# Altium schematic sheet KeepTalkingV2_SevenSeg.SchDoc
size A; SheetNumber: 2; SheetTotal: 2
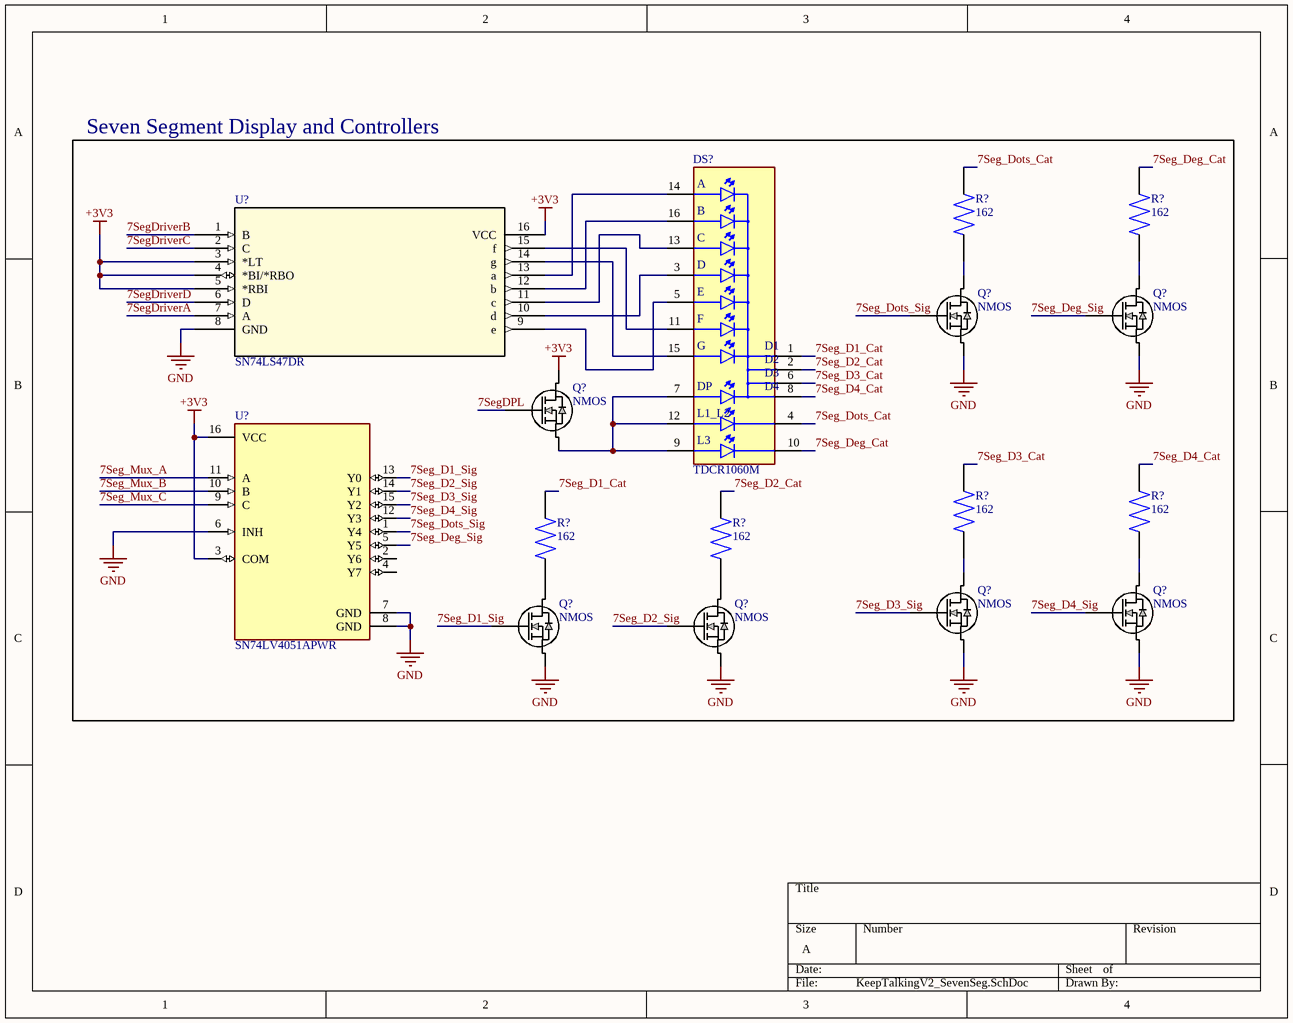
[diagram p0: KeepTalkingV2_SevenSeg.SchDoc]

## Parts
(Parts that share a designator on the sheet are numbered #1, #2 ... from top to bottom, then left to right.)
DS?  TDCR1060M  [16-DIP 4Char-7Seg]
Q?#1  NMOS  [SOT-323 MOS]
Q?#2  NMOS  [SOT-323 MOS]
Q?#3  NMOS  [SOT-323 MOS]
Q?#4  NMOS  [SOT-323 MOS]
Q?#5  NMOS  [SOT-323 MOS]
Q?#6  NMOS  [SOT-323 MOS]
Q?#7  NMOS  [SOT-323 MOS]
R?#1  162  [0805]
R?#2  162  [0805]
R?#3  162  [0805]
R?#4  162  [0805]
R?#5  162  [0805]
R?#6  162  [0805]
U?#1  SN74LS47DR  [16-SOIC 7-seg Driver]
U?#2  SN74LV4051APWR  [16-TSSOP MUX 8to1]

## Blocks framed on the sheet
Seven Segment Display and Controllers: DS? Q?#1-Q?#7 R?#1-R?#6 U?#1 U?#2

## Nets
+3V3: Q?#3.2(D) U?#1.3(*LT) U?#1.4(*BI/*RBO) U?#1.5(*RBI) U?#1.16(VCC) U?#2.3(COM) U?#2.16(VCC)
GND: Q?#1.3(S) Q?#2.3(S) Q?#4.3(S) Q?#5.3(S) Q?#6.3(S) Q?#7.3(S) U?#1.8(GND) U?#2.6(INH) U?#2.7(GND) U?#2.8(GND)
7Seg_D1_Cat: DS?.1(D1) R?#5.2
7Seg_D1_Sig: Q?#6.1(G) U?#2.13(Y0)
7Seg_D2_Cat: DS?.2(D2) R?#6.2
7Seg_D2_Sig: Q?#7.1(G) U?#2.14(Y1)
7Seg_D3_Cat: DS?.6(D3) R?#3.2
7Seg_D3_Sig: Q?#4.1(G) U?#2.15(Y2)
7Seg_D4_Cat: DS?.8(D4) R?#4.2
7Seg_D4_Sig: Q?#5.1(G) U?#2.12(Y3)
7Seg_Deg_Cat: DS?.10 R?#2.2
7Seg_Deg_Sig: Q?#2.1(G) U?#2.5(Y5)
7Seg_Dots_Cat: DS?.4 R?#1.2
7Seg_Dots_Sig: Q?#1.1(G) U?#2.1(Y4)
7Seg_Mux_A: U?#2.11(A)
7Seg_Mux_B: U?#2.10(B)
7Seg_Mux_C: U?#2.9(C)
7SegDPL: Q?#3.1(G)
7SegDriverA: U?#1.7(A)
7SegDriverB: U?#1.1(B)
7SegDriverC: U?#1.2(C)
7SegDriverD: U?#1.6(D)
NetDS?_3: DS?.3(D) U?#1.10(d)
NetDS?_5: DS?.5(E) U?#1.9(e)
NetDS?_7: DS?.7(DP) DS?.9(L3) DS?.12(L1_L2) Q?#3.3(S)
NetDS?_11: DS?.11(F) U?#1.15(f)
NetDS?_13: DS?.13(C) U?#1.11(c)
NetDS?_14: DS?.14(A) U?#1.13(a)
NetDS?_15: DS?.15(G) U?#1.14(g)
NetDS?_16: DS?.16(B) U?#1.12(b)
NetQ?#1_2: Q?#1.2(D) R?#1.1
NetQ?#2_2: Q?#2.2(D) R?#2.1
NetQ?#4_2: Q?#4.2(D) R?#3.1
NetQ?#5_2: Q?#5.2(D) R?#4.1
NetQ?#6_2: Q?#6.2(D) R?#5.1
NetQ?#7_2: Q?#7.2(D) R?#6.1

Not connected (* = marked no-connect by the designer): U?#2 2(Y6) 4(Y7)

## Library data of the parts
DS? = DISP 7-seg 4Char Clock: Clock LED Display, 4-Character, Red, 10mm; Manufacturer: Vishay; Forward Current: 25mA; Forward Voltage: 2.4V; Number of Characters: 4; Supplier: Digikey; Supplier Part Number: TDCR1060M-ND; Manufacturer Part Number: TDCR1060M; RoHS: Yes; Category: Optoelectronics; Stock: 3748; Pricing: 1=3.34, 12=2.39083, 108=1.8975, 504=1.67593, 1008=1.59991, 2004=1.53608, 5004=1.46597 (USD); Color: Red; Color@wavelength: Red; Min Operating Temperature: -40°C; Max Operating Temperature: 85°C; Display Height: 10mm; Channels: 4; Optoelectronic Device Type: CLOCK LED DISPLAY; RoHS Compliant: Yes; ComponentLink1URL: https://datasheet.ciiva.com:443/pdfs/VipMasterIC/IC/VISH/VISH-S-A0003301798/VISH-S-A0004391181-1.pdf?src-supplier=IHS+Markit; ComponentLink1Description: https://datasheet.ciiva.com:443/pdfs/VipMasterIC/IC/VISH/VISH-S-A0003301798/VISH-S-A0004391181-1.pdf?src-supplier=IHS+Markit; ComponentLink2URL: https://datasheet.ciiva.com/18549/tdc10m-18549753.pdf?src-supplier=Digikey; ComponentLink2Description: https://datasheet.ciiva.com/18549/tdc10m-18549753.pdf?src-supplier=Digikey
Q?#1-Q?#7 = MOS NMOS 20V 1A SOT323: Small Signal Field-Effect Transistor, 1A I(D), 20V, 1-Element, N-Channel, Silicon, Metal-oxide Semiconductor FET; Manufacturer: Diodes Zetex; Manufacturer Part Number: DMG1012UW-7; Package Body Material: Plastic; Time @ Peak Reflow Temperature-Max (s): 40s; Additional Feature: HIGH RELIABILITY; Drain-source On Resistance-Max: 450mR; Number of Elements: 1; Operating Mode: ENHANCEMENT MODE; Power Dissipation-Max (Abs): 290mW; Transistor Application: SWITCHING; Reference Standard: AEC-Q101; Qualification Status: Not Qualified; Supplier: Digikey; Supplier Part Number: DMG1012UW-7DICT-ND; RoHS: Yes; Category: MOSFETs; Stock: 318650; Pricing: 1=0.28, 10=0.143, 100=0.0714, 500=0.06828 (USD); Pins: 3; Package Shape: Rectangular; Terminal Finish: Tin; Transistor Element Material: SILICON; Max Operating Temperature: 150°C; JESD-609 Code: e3; JESD-30 Code: R-PDSO-G3; Moisture Sensitivity Level: 1; Package Style: SMALL OUTLINEMeter; Peak Reflow Temperature (Cel): 260°C; Surface Mount: Yes; Terminal Form: Gull Wing; Terminal Position: DUAL; Polarity/Channel Type: N-CHANNEL; Drain Current-Max (Abs) (ID): 1A; Drain Current-Max (ID): 1A; DS Breakdown Voltage-Min: 20V; FET Technology: METAL-OXIDE SEMICONDUCTOR; Reach SVHC Compliant: Yes; RoHS Compliant: Yes; ComponentLink1URL: https://datasheet.ciiva.com:443/pdfs/VipMasterIC/IC/DIOD/DIOD-S-A0009689761/DIOD-S-A0009691185-1.pdf?src-supplier=IHS+Markit; ComponentLink1Description: https://datasheet.ciiva.com:443/pdfs/VipMasterIC/IC/DIOD/DIOD-S-A0009689761/DIOD-S-A0009691185-1.pdf?src-supplier=IHS+Markit; ComponentLink2URL: https://datasheet.ciiva.com/11174/ds31859-11174966.pdf?src-supplier=Avnet; ComponentLink2Description: https://datasheet.ciiva.com/11174/ds31859-11174966.pdf?src-supplier=Avnet; ComponentLink3URL: https://datasheet.ciiva.com/4443/ds31859-90313-4443117.pdf?src-supplier=Mouser; ComponentLink3Description: https://datasheet.ciiva.com/4443/ds31859-90313-4443117.pdf?src-supplier=Mouser; ComponentLink4URL: https://datasheet.ciiva.com/6383/ds31859-6383798.pdf?src-supplier=Digikey; ComponentLink4Description: https://datasheet.ciiva.com/6383/ds31859-6383798.pdf?src-supplier=Digikey; ComponentLink5URL: https://datasheet.ciiva.com/6383/ds31859-6383800.pdf?src-supplier=Digikey; ComponentLink5Description: https://datasheet.ciiva.com/6383/ds31859-6383800.pdf?src-supplier=Digikey
R?#1-R?#6 = RES 162 1% 0.125W 0805: Fixed Resistor, Metal Glaze/thick Film, 0.125W, 162ohm, 150V, 1% +/-Tol, 100ppm/Cel, Surface Mount, 0805; Manufacturer: Yageo; Manufacturer Part Number: RC0805FR-07162RL; Additional Feature: LASER TRIMMABLE; Power: 125mW; Rated Temperature: 70°C; Value: 162R; Temperature Coefficient (ppm/Cel): 100; Package Height: 0.5mm; Package Length: 2mm; Package Width: 1.25mm; Supplier: Digikey; Supplier Part Number: 311-162CRCT-ND; RoHS: Yes; Category: Chip SMD Resistors; Stock: 65718; Pricing: 1=0.1, 10=0.013, 100=0.0112, 1000=0.00816, 2500=0.00735 (USD); Mounting Technology: Surface Mount; Pins: 2; Package Shape: Rectangular; Case/Package: 0805; Terminal Finish: Nickel; Min Operating Temperature: -55°C; Max Operating Temperature: 155°C; Tolerance: 1%; JESD-609 Code: e3; Resistor Type: FIXED RESISTOR; Construction: Chip; Packaging: Tape and Reel; Technology: METAL GLAZE/THICK FILM; Termination: Wraparound; Working Voltage: 150V; Reach SVHC Compliant: Yes; RoHS Compliant: Yes; ComponentLink1URL: https://datasheet.ciiva.com:443/pdfs/VipMasterIC/IC/YAGO/YAGO-S-A0008145938/YAGO-S-A0008145938-1.pdf?src-supplier=IHS+Markit; ComponentLink1Description: https://datasheet.ciiva.com:443/pdfs/VipMasterIC/IC/YAGO/YAGO-S-A0008145938/YAGO-S-A0008145938-1.pdf?src-supplier=IHS+Markit; ComponentLink2URL: https://datasheet.ciiva.com/2457/pyu-r-int-thick-7-2457830.pdf?src-supplier=Digikey; ComponentLink2Description: https://datasheet.ciiva.com/2457/pyu-r-int-thick-7-2457830.pdf?src-supplier=Digikey; ComponentLink3URL: https://datasheet.ciiva.com/2457/pyu-r-int-thick-7-2457831.pdf?src-supplier=Digikey; ComponentLink3Description: https://datasheet.ciiva.com/2457/pyu-r-int-thick-7-2457831.pdf?src-supplier=Digikey; ComponentLink4URL: https://datasheet.ciiva.com/2457/pyu-r-int-thick-7-2457832.pdf?src-supplier=Digikey; ComponentLink4Description: https://datasheet.ciiva.com/2457/pyu-r-int-thick-7-2457832.pdf?src-supplier=Digikey
U?#1 = IC DRVR 7 SEG SN74LS47DR: Seven Segment Decoder/Driver, LS Series, Inverted Output, TTL, PDSO16; Manufacturer: Texas Instruments; Package Body Material: Plastic; Input Conditioning: STANDARD; Load Capacitance (CL): 15pF; Channels: 1; Output Characteristics: OPEN-COLLECTOR; Power Supply Current-Max (ICC): 13mA; Propagation Delay (tpd): 100ns; Max Supply Voltage: 5.5V; Min Supply Voltage: 4.75V; Nominal Supply Voltage: 5V; Qualification Status: Not Qualified; Supplier: Digikey; Supplier Part Number: 296-46894-1-ND; Manufacturer Part Number: SN74LS47DR; RoHS: Yes; Category: Integrated Circuits (ICs); Stock: 3469; Pricing: 1=1.33, 10=0.967, 25=0.876, 100=0.7762, 250=0.72848, 500=0.70992 (USD); Case/Package: SOP; Pins: 16; Package Shape: Rectangular; Terminal Finish: Nickel; Min Operating Temperature: 0°C; Max Operating Temperature: 70°C; JESD-609 Code: e4; Output Polarity: INVERTED; JESD-30 Code: R-PDSO-G16; Logic Type: SEVEN SEGMENT DECODER/DRIVER; Moisture Sensitivity Level: 1; Package Style: SMALL OUTLINEMeter; Peak Reflow Temperature (Cel): 260°C; Surface Mount: Yes; Technology: TTL; Terminal Form: Gull Wing; Terminal Position: DUAL; Length: 9.9mm; Width: 3.9mm; Height - Seated (Max): 1.75mm; Terminal Pitch: 1.27mm; Temperature Grade: COMMERCIAL; Reach SVHC Compliant: Yes; RoHS Compliant: Yes; ComponentLink1URL: https://www.ti.com:443/lit/ds/symlink/sn5447a.pdf?src-supplier=IHS+Markit; ComponentLink1Description: https://www.ti.com:443/lit/ds/symlink/sn5447a.pdf?src-supplier=IHS+Markit; ComponentLink2URL: https://datasheet.ciiva.com/14293/sn74ls47-14293676.pdf?src-supplier=Avnet; ComponentLink2Description: https://datasheet.ciiva.com/14293/sn74ls47-14293676.pdf?src-supplier=Avnet
U?#2 = IC MUX 8:1 SN74LV4051APWR: Single-Ended Multiplexer, 1 Func, 8 Channel, CMOS, PDSO16; Manufacturer: Texas Instruments; Package Body Material: Plastic; Number of Channels: 8; Channels: 1; Off-state Isolation-Nom: 45dB; On-state Resistance Match-Nom: 2.1R; On-state Resistance-Max (Ron): 180R; Package Equivalence Code: TSSOP16,.25; Power Supplies: 3.3V; Signal Current-Max: 50mA; Supply Current-Max (Isup): 20uA; Max Supply Voltage: 5.5V; Min Supply Voltage: 2V; Nominal Supply Voltage: 2.3V; Switch-off Time-Max: 28ns; Qualification Status: Not Qualified; Supplier: Digikey; Supplier Part Number: 296-3829-1-ND; Manufacturer Part Number: SN74LV4051APWR; RoHS: Yes; Category: Decoders and Multiplexers; Stock: 20567; Pricing: 1=0.27, 10=0.189, 25=0.1672, 100=0.1435, 250=0.13224, 500=0.12538, 1000=0.11977 (USD); Case/Package: TSSOP; Pins: 16; Package Shape: Rectangular; Terminal Finish: Tin; Min Operating Temperature: -40°C; Max Operating Temperature: 85°C; JESD-609 Code: e3; Throw Configuration: SINGLE-ENDED MULTIPLEXER; JESD-30 Code: R-PDSO-G16; Moisture Sensitivity Level: 1; Package Style: SMALL OUTLINE, THIN PROFILE, SHRINK PITCHMeter; Peak Reflow Temperature (Cel): 260°C; Surface Mount: Yes; Switch-on Time-Max: 28ns; Technology: CMOS; Terminal Form: Gull Wing; Terminal Position: DUAL; Length: 5mm; Width: 4.4mm; Height - Seated (Max): 1.2mm; Terminal Pitch: 0.65mm; Temperature Grade: INDUSTRIAL; Reach SVHC Compliant: Yes; RoHS Compliant: Yes; ComponentLink1URL: https://www.ti.com:443/lit/ds/symlink/sn74lv4051a.pdf?src-supplier=IHS+Markit; ComponentLink1Description: https://www.ti.com:443/lit/ds/symlink/sn74lv4051a.pdf?src-supplier=IHS+Markit; ComponentLink2URL: https://datasheet.ciiva.com/27051/1026350-27051257.pdf?src-supplier=Jameco; ComponentLink2Description: https://datasheet.ciiva.com/27051/1026350-27051257.pdf?src-supplier=Jameco; ComponentLink3URL: https://datasheet.ciiva.com/15127/getdatasheetpartid-300450-15127659.pdf?src-supplier=Verical; ComponentLink3Description: https://datasheet.ciiva.com/15127/getdatasheetpartid-300450-15127659.pdf?src-supplier=Verical; ComponentLink4URL: https://datasheet.ciiva.com/1669/sn74lv4051a-1669786.pdf?src-supplier=Digikey; ComponentLink4Description: https://datasheet.ciiva.com/1669/sn74lv4051a-1669786.pdf?src-supplier=Digikey; ComponentLink5URL: https://datasheet.ciiva.com/1669/sn74lv4051a-1669787.pdf?src-supplier=Digikey; ComponentLink5Description: https://datasheet.ciiva.com/1669/sn74lv4051a-1669787.pdf?src-supplier=Digikey; ComponentLink6URL: https://datasheet.ciiva.com/1669/sn74lv4051a-1669788.pdf?src-supplier=Digikey; ComponentLink6Description: https://datasheet.ciiva.com/1669/sn74lv4051a-1669788.pdf?src-supplier=Digikey; ComponentLink7URL: https://datasheet.ciiva.com/2980/sn74lv4051a-2980182.pdf?src-supplier=Avnet; ComponentLink7Description: https://datasheet.ciiva.com/2980/sn74lv4051a-2980182.pdf?src-supplier=Avnet; ComponentLink8URL: https://datasheet.ciiva.com/48711/001048021-da-01-en-ic-de-mux-8x-sn74lv4051apwr-tssop-16-tid-48711975.pdf?src-supplier=Conrad; ComponentLink8Description: https://datasheet.ciiva.com/48711/001048021-da-01-en-ic-de-mux-8x-sn74lv4051apwr-tssop-16-tid-48711975.pdf?src-supplier=Conrad